# EAGLE design Hardware-Neuron (EAGLE 9.3.0)
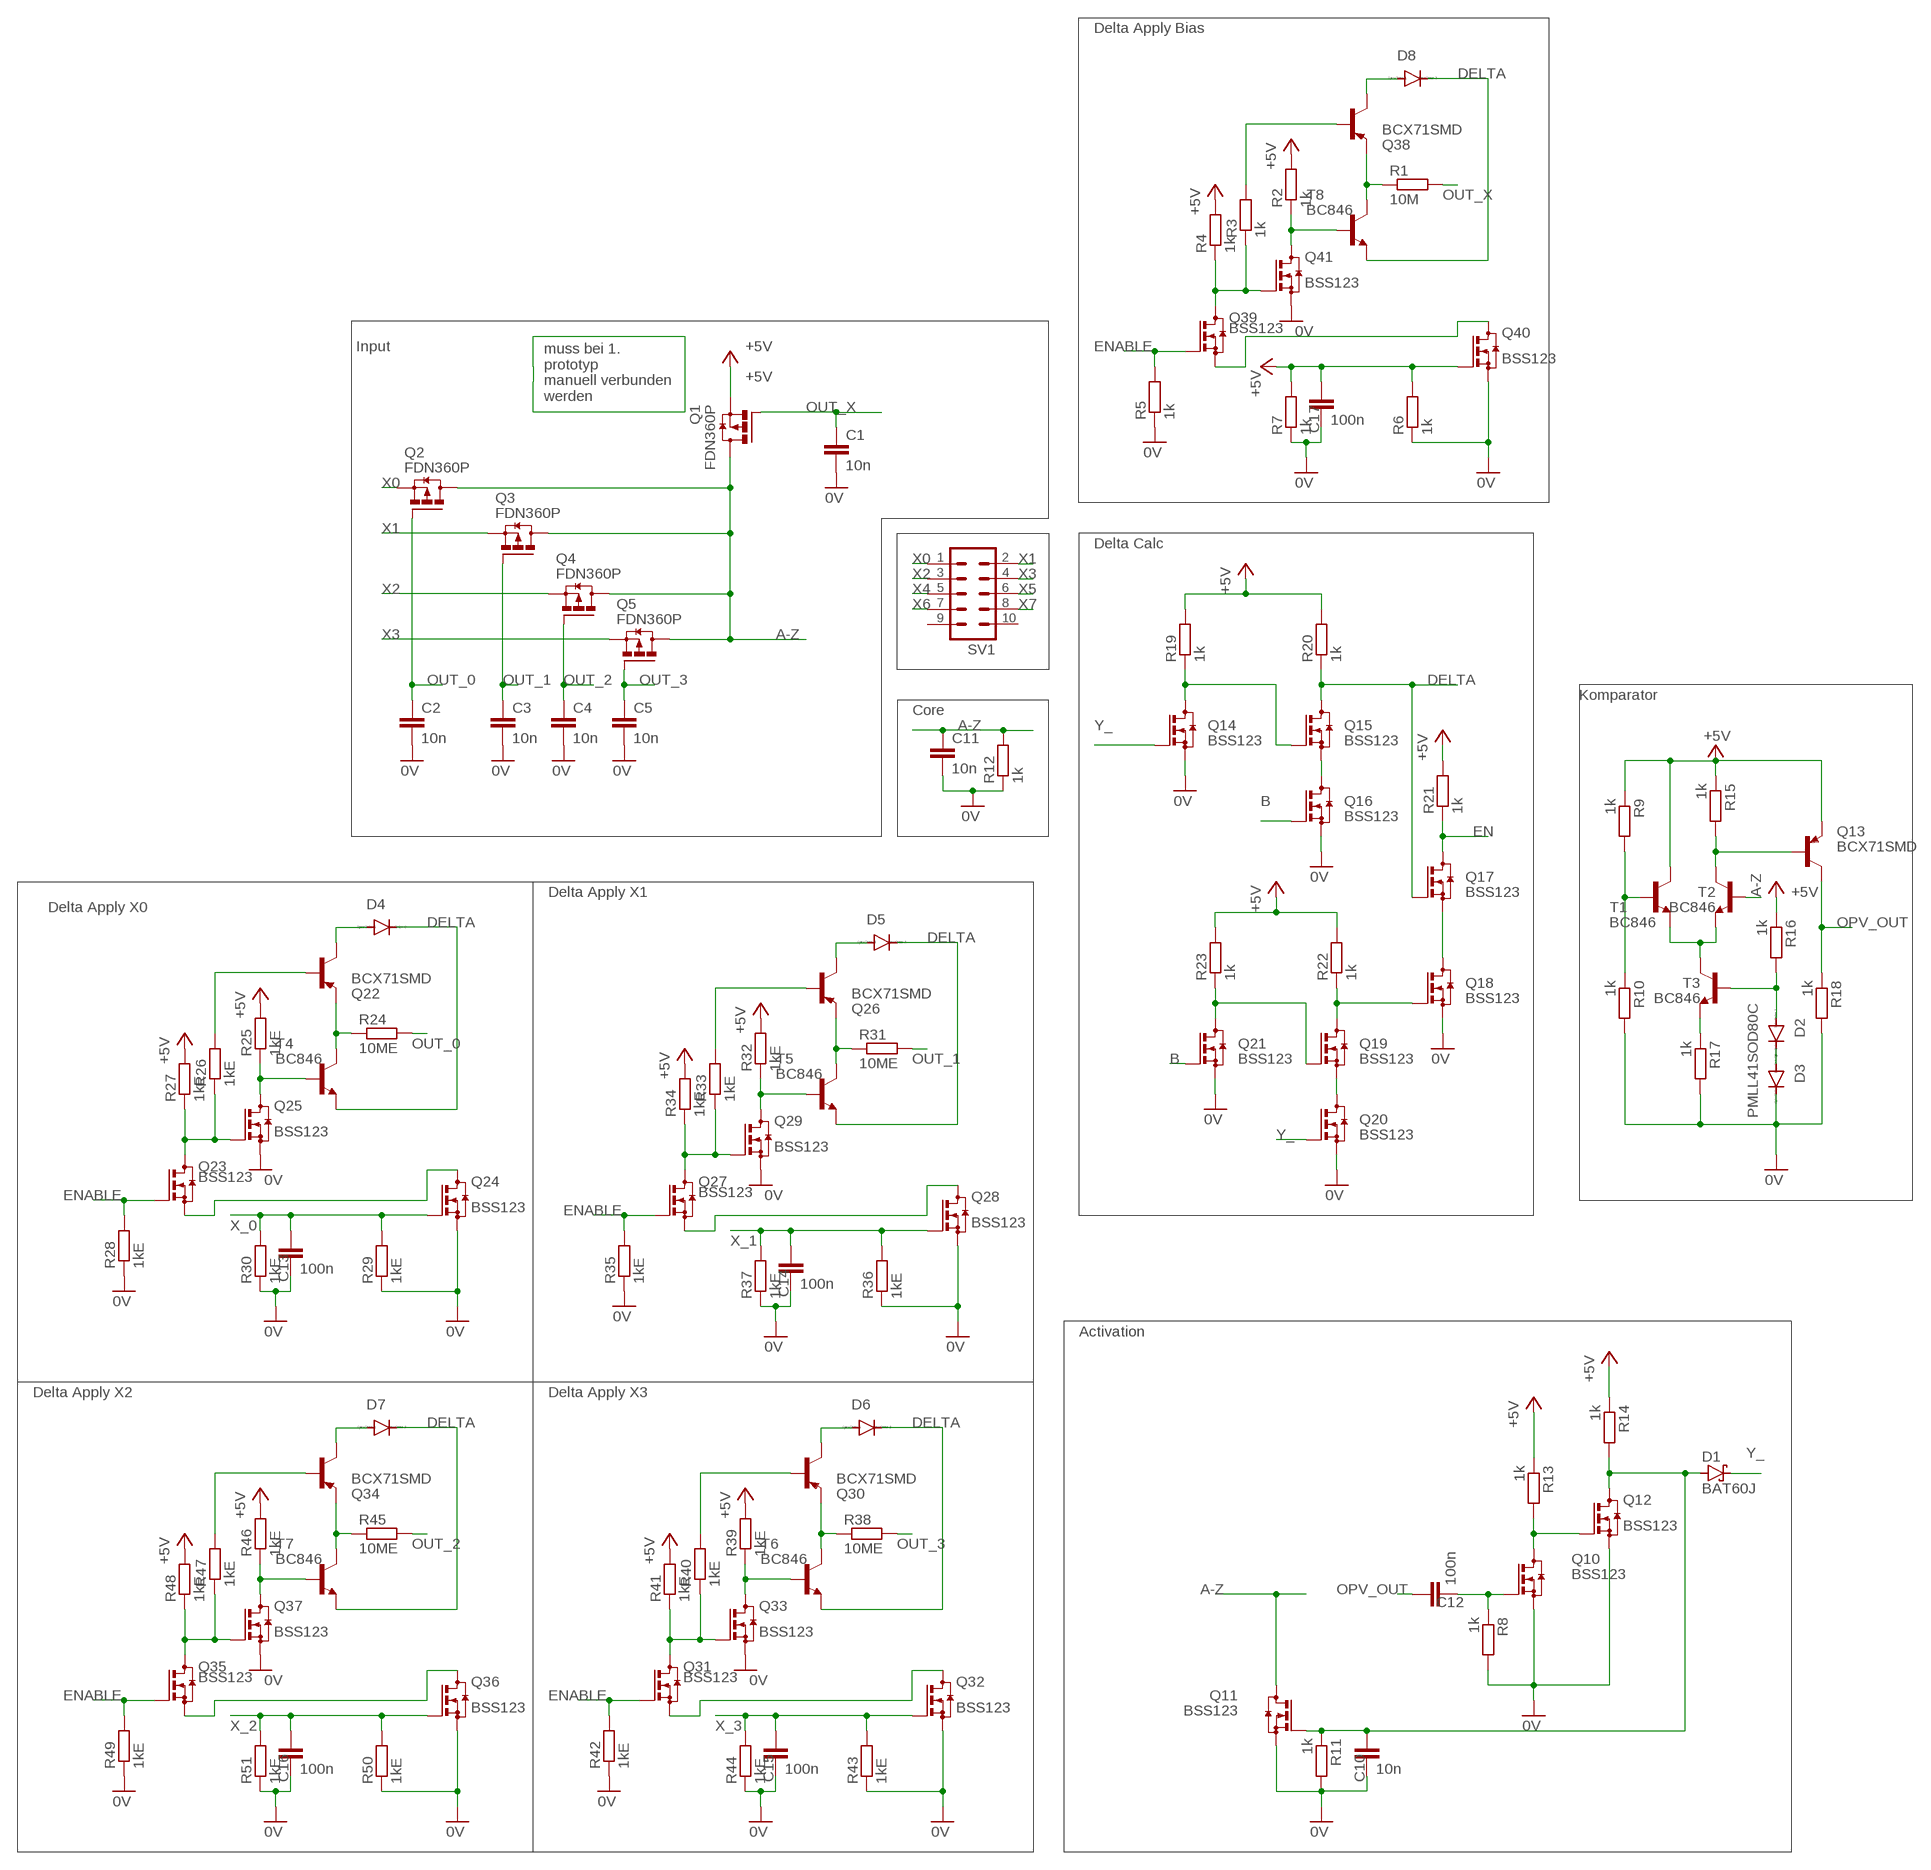
[diagram p0: schematic, sheet 1]

## Parts
C1  10n  C-EUC1206  [C1206]
C2  10n  C-EUC1206  [C1206]
C3  10n  C-EUC1206  [C1206]
C4  10n  C-EUC1206  [C1206]
C5  10n  C-EUC1206  [C1206]
C10  10n  C-EUC1206  [C1206]
C11  10n  C-EUC1206  [C1206]
C12  100n  C-EUC1206  [C1206]
C13  100n  C-EUC1206  [C1206]
C14  100n  C-EUC1206  [C1206]
C15  100n  C-EUC1206  [C1206]
C16  100n  C-EUC1206  [C1206]
C17  100n  C-EUC1206  [C1206]
D1  BAT60J  [SOD323_ST]
D2  PMLL41SOD80C  [SOD80C]
D3  PMLL41SOD80C  [SOD80C]
D4  PMLL41SOD80C  [SOD80C]
D5  PMLL41SOD80C  [SOD80C]
D6  PMLL41SOD80C  [SOD80C]
D7  PMLL41SOD80C  [SOD80C]
D8  PMLL41SOD80C  [SOD80C]
Q1  FDN360P  [SUPER-SOT3]
Q2  FDN360P  [SUPER-SOT3]
Q3  FDN360P  [SUPER-SOT3]
Q4  FDN360P  [SUPER-SOT3]
Q5  FDN360P  [SUPER-SOT3]
Q10  BSS123  [SOT23]
Q11  BSS123  [SOT23]
Q12  BSS123  [SOT23]
Q13  BCX71SMD  [SOT23]
Q14  BSS123  [SOT23]
Q15  BSS123  [SOT23]
Q16  BSS123  [SOT23]
Q17  BSS123  [SOT23]
Q18  BSS123  [SOT23]
Q19  BSS123  [SOT23]
Q20  BSS123  [SOT23]
Q21  BSS123  [SOT23]
Q22  BCX71SMD  [SOT23]
Q23  BSS123  [SOT23]
Q24  BSS123  [SOT23]
Q25  BSS123  [SOT23]
Q26  BCX71SMD  [SOT23]
Q27  BSS123  [SOT23]
Q28  BSS123  [SOT23]
Q29  BSS123  [SOT23]
Q30  BCX71SMD  [SOT23]
Q31  BSS123  [SOT23]
Q32  BSS123  [SOT23]
Q33  BSS123  [SOT23]
Q34  BCX71SMD  [SOT23]
Q35  BSS123  [SOT23]
Q36  BSS123  [SOT23]
Q37  BSS123  [SOT23]
Q38  BCX71SMD  [SOT23]
Q39  BSS123  [SOT23]
Q40  BSS123  [SOT23]
Q41  BSS123  [SOT23]
R1  10M  R-EU_R1206  [R1206]
R2  1k  R-EU_R1206  [R1206]
R3  1k  R-EU_R1206  [R1206]
R4  1k  R-EU_R1206  [R1206]
R5  1k  R-EU_R1206  [R1206]
R6  1k  R-EU_R1206  [R1206]
R7  1k  R-EU_R1206  [R1206]
R8  1k  R-EU_R1206  [R1206]
R9  1k  R-EU_R1206  [R1206]
R10  1k  R-EU_R1206  [R1206]
R11  1k  R-EU_R1206  [R1206]
R12  1k  R-EU_R1206  [R1206]
R13  1k  R-EU_R1206  [R1206]
R14  1k  R-EU_R1206  [R1206]
R15  1k  R-EU_R1206  [R1206]
R16  1k  R-EU_R1206  [R1206]
R17  1k  R-EU_R1206  [R1206]
R18  1k  R-EU_R1206  [R1206]
R19  1k  R-EU_R1206  [R1206]
R20  1k  R-EU_R1206  [R1206]
R21  1k  R-EU_R1206  [R1206]
R22  1k  R-EU_R1206  [R1206]
R23  1k  R-EU_R1206  [R1206]
R24  10ME  R-EU_R1206  [R1206]
R25  1kE  R-EU_R1206  [R1206]
R26  1kE  R-EU_R1206  [R1206]
R27  1kE  R-EU_R1206  [R1206]
R28  1kE  R-EU_R1206  [R1206]
R29  1kE  R-EU_R1206  [R1206]
R30  1kE  R-EU_R1206  [R1206]
R31  10ME  R-EU_R1206  [R1206]
R32  1kE  R-EU_R1206  [R1206]
R33  1kE  R-EU_R1206  [R1206]
R34  1kE  R-EU_R1206  [R1206]
R35  1kE  R-EU_R1206  [R1206]
R36  1kE  R-EU_R1206  [R1206]
R37  1kE  R-EU_R1206  [R1206]
R38  10ME  R-EU_R1206  [R1206]
R39  1kE  R-EU_R1206  [R1206]
R40  1kE  R-EU_R1206  [R1206]
R41  1kE  R-EU_R1206  [R1206]
R42  1kE  R-EU_R1206  [R1206]
R43  1kE  R-EU_R1206  [R1206]
R44  1kE  R-EU_R1206  [R1206]
R45  10ME  R-EU_R1206  [R1206]
R46  1kE  R-EU_R1206  [R1206]
R47  1kE  R-EU_R1206  [R1206]
R48  1kE  R-EU_R1206  [R1206]
R49  1kE  R-EU_R1206  [R1206]
R50  1kE  R-EU_R1206  [R1206]
R51  1kE  R-EU_R1206  [R1206]
SV1  ML10  [ML10]
T1  BC846  [SOT23]
T2  BC846  [SOT23]
T3  BC846  [SOT23]
T4  BC846  [SOT23]
T5  BC846  [SOT23]
T6  BC846  [SOT23]
T7  BC846  [SOT23]
T8  BC846  [SOT23]

## Nets
0V: C1.2 C2.2 C3.2 C4.2 C5.2 C10.2 C11.2 C13.2 C14.2 C15.2 C16.2 C17.2 D3.C Q10.2(S) Q11.2(S) Q12.2(S) Q14.2(S) Q16.2(S) Q18.2(S) Q20.2(S) Q21.2(S) Q24.2(S) Q25.2(S) Q28.2(S) Q29.2(S) Q32.2(S) Q33.2(S) Q36.2(S) Q37.2(S) Q40.2(S) Q41.2(S) R5.1 R6.1 R7.1 R8.2 R10.2 R11.2 R12.1 R17.2 R18.2 R28.1 R29.1 R30.1 R35.1 R36.1 R37.1 R42.1 R43.1 R44.1 R49.1 R50.1 R51.1
+5V: C17.1 Q1.2(S) Q13.2(E) Q40.1(G) R2.2 R4.2 R6.2 R7.2 R9.1 R13.1 R14.1 R15.1 R16.1 R19.2 R20.2 R21.2 R22.2 R23.2 R25.2 R27.2 R32.2 R34.2 R39.2 R41.2 R46.2 R48.2 T1.3(C)
A-Z: C11.1 Q1.3(D) Q2.3(D) Q3.3(D) Q4.3(D) Q5.3(D) Q11.3(D) R12.2 T2.1(B)
B: Q16.1(G) Q21.1(G)
DELTA: D4.C D5.C D6.C D7.C D8.C Q15.3(D) Q17.1(G) R20.1 T4.2(E) T5.2(E) T6.2(E) T7.2(E) T8.2(E)
EN: Q17.3(D) R21.1
ENABLE: Q23.1(G) Q27.1(G) Q31.1(G) Q35.1(G) Q39.1(G) R5.2 R28.2 R35.2 R42.2 R49.2
N$1: Q41.3(D) R2.1 T8.1(B)
N$2: Q38.2(E) R1.1 T8.3(C)
N$3: C12.2 Q10.1(G) R8.1
N$4: C10.1 D1.A Q11.1(G) Q12.3(D) R11.1 R14.2
N$5: Q10.3(D) Q12.1(G) R13.2
N$6: Q25.3(D) R25.1 T4.1(B)
N$7: Q23.2(S) Q24.3(D)
N$8: Q22.2(E) R24.1 T4.3(C)
N$9: D8.A Q38.3(C)
N$10: Q38.1(B) R3.2
N$11: Q39.3(D) Q41.1(G) R3.1 R4.1
N$12: Q39.2(S) Q40.3(D)
N$13: D2.C D3.A
N$14: R9.2 R10.1 T1.1(B)
N$25: R17.1 T3.2(E)
N$26: Q13.1(B) R15.2 T2.3(C)
N$27: T1.2(E) T2.2(E) T3.3(C)
N$28: Q29.3(D) R32.1 T5.1(B)
N$29: D2.A R16.2 T3.1(B)
N$30: Q14.3(D) Q15.1(G) R19.1
N$31: D4.A Q22.3(C)
N$32: Q15.2(S) Q16.3(D)
N$33: Q26.2(E) R31.1 T5.3(C)
N$34: Q22.1(B) R26.2
N$35: Q23.3(D) Q25.1(G) R26.1 R27.1
N$36: Q18.1(G) Q19.3(D) R22.1
N$37: Q19.1(G) Q21.3(D) R23.1
N$38: D5.A Q26.3(C)
N$39: Q26.1(B) R33.2
N$40: Q17.2(S) Q18.3(D)
N$41: Q27.3(D) Q29.1(G) R33.1 R34.1
N$42: Q27.2(S) Q28.3(D)
N$43: Q19.2(S) Q20.3(D)
N$44: Q33.3(D) R39.1 T6.1(B)
N$45: Q30.2(E) R38.1 T6.3(C)
N$46: D6.A Q30.3(C)
N$47: Q30.1(B) R40.2
N$48: Q31.3(D) Q33.1(G) R40.1 R41.1
N$49: Q31.2(S) Q32.3(D)
N$50: Q37.3(D) R46.1 T7.1(B)
N$51: Q34.2(E) R45.1 T7.3(C)
N$52: D7.A Q34.3(C)
N$53: Q34.1(B) R47.2
N$54: Q35.3(D) Q37.1(G) R47.1 R48.1
N$55: Q35.2(S) Q36.3(D)
OPV_OUT: C12.1 Q13.3(C) R18.1
OUT_0: C2.1 Q2.1(G) R24.2
OUT_1: C3.1 Q3.1(G) R31.2
OUT_2: C4.1 Q4.1(G) R45.2
OUT_3: C5.1 Q5.1(G) R38.2
OUT_X: C1.1 Q1.1(G) R1.2
X0: Q2.2(S) SV1.1
X1: Q3.2(S) SV1.2
X2: Q4.2(S) SV1.3
X3: Q5.2(S) SV1.4
X4: SV1.5
X5: SV1.6
X6: SV1.7
X7: SV1.8
X_0: C13.1 Q24.1(G) R29.2 R30.2
X_1: C14.1 Q28.1(G) R36.2 R37.2
X_2: C16.1 Q36.1(G) R50.2 R51.2
X_3: C15.1 Q32.1(G) R43.2 R44.2
Y_: D1.C Q14.1(G) Q20.1(G)
Unconnected: SV1.9 SV1.10

## Notes on the sheet
- Delta Apply Bias
- Input
- muss bei 1.
  prototyp 
  manuell verbunden
  werden
- Delta Calc
- Komparator
- Core
- Delta Apply X1
- Delta Apply X0
- Activation
- Delta Apply X2 | Delta Apply X3

## Library data of the parts
C1-C5 C10-C17 = rcl:C-EU: CAPACITOR, European symbol; SPICEPREFIX: C
D1 = diode:BAT60J: Schottky barrier diode Source: www.st.com, BAT60J.pdf
D2-D8 = diode:PMLL41*: High-speed diodes Source: http://www.semiconductors.philips.com/acrobat_download/datasheets/PMLL4150_2.pdf
Q1-Q5 = transistor-power:FDN360P: Single P-Channel, PowerTrench (R) MOSFET Source: http://www.fairchildsemi.com/ds/FD/FDN360P.pdf
Q10-Q12 Q14-Q21 Q23-Q25 Q27-Q29 Q31-Q33 Q35-Q37 Q39-Q41 = transistor-small-signal:BSS123: N-CHANNEL MOS FET
Q13 Q22 Q26 Q30 Q34 Q38 = transistor-pnp:BCX71SMD: PNP Transistor
R1-R51 = rcl:R-EU_: RESISTOR, European symbol; SPICEPREFIX: R
SV1 = con-harting-ml:ML10: HARTING; OC_FARNELL: unknown; OC_NEWARK: unknown
T1-T8 = transistor:BC846: NPN TRANSISTOR

## Board
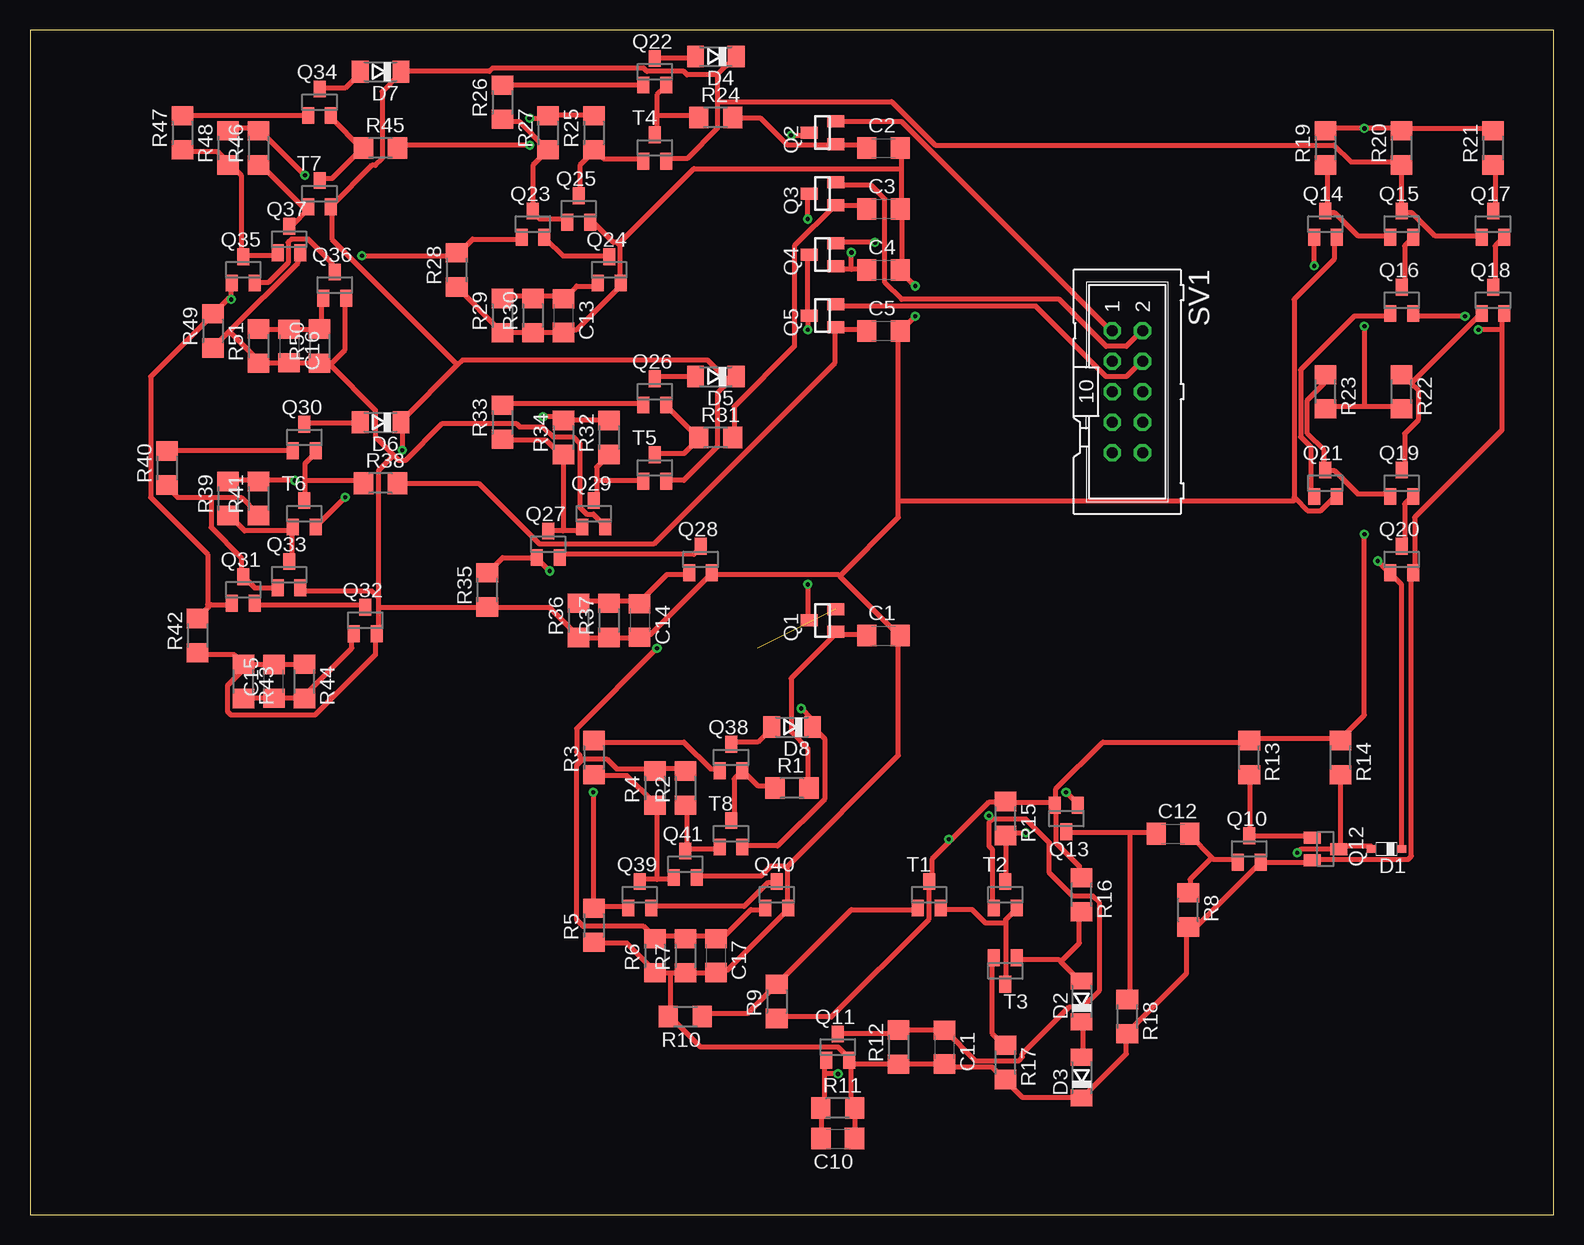
[diagram p1: board, top side]
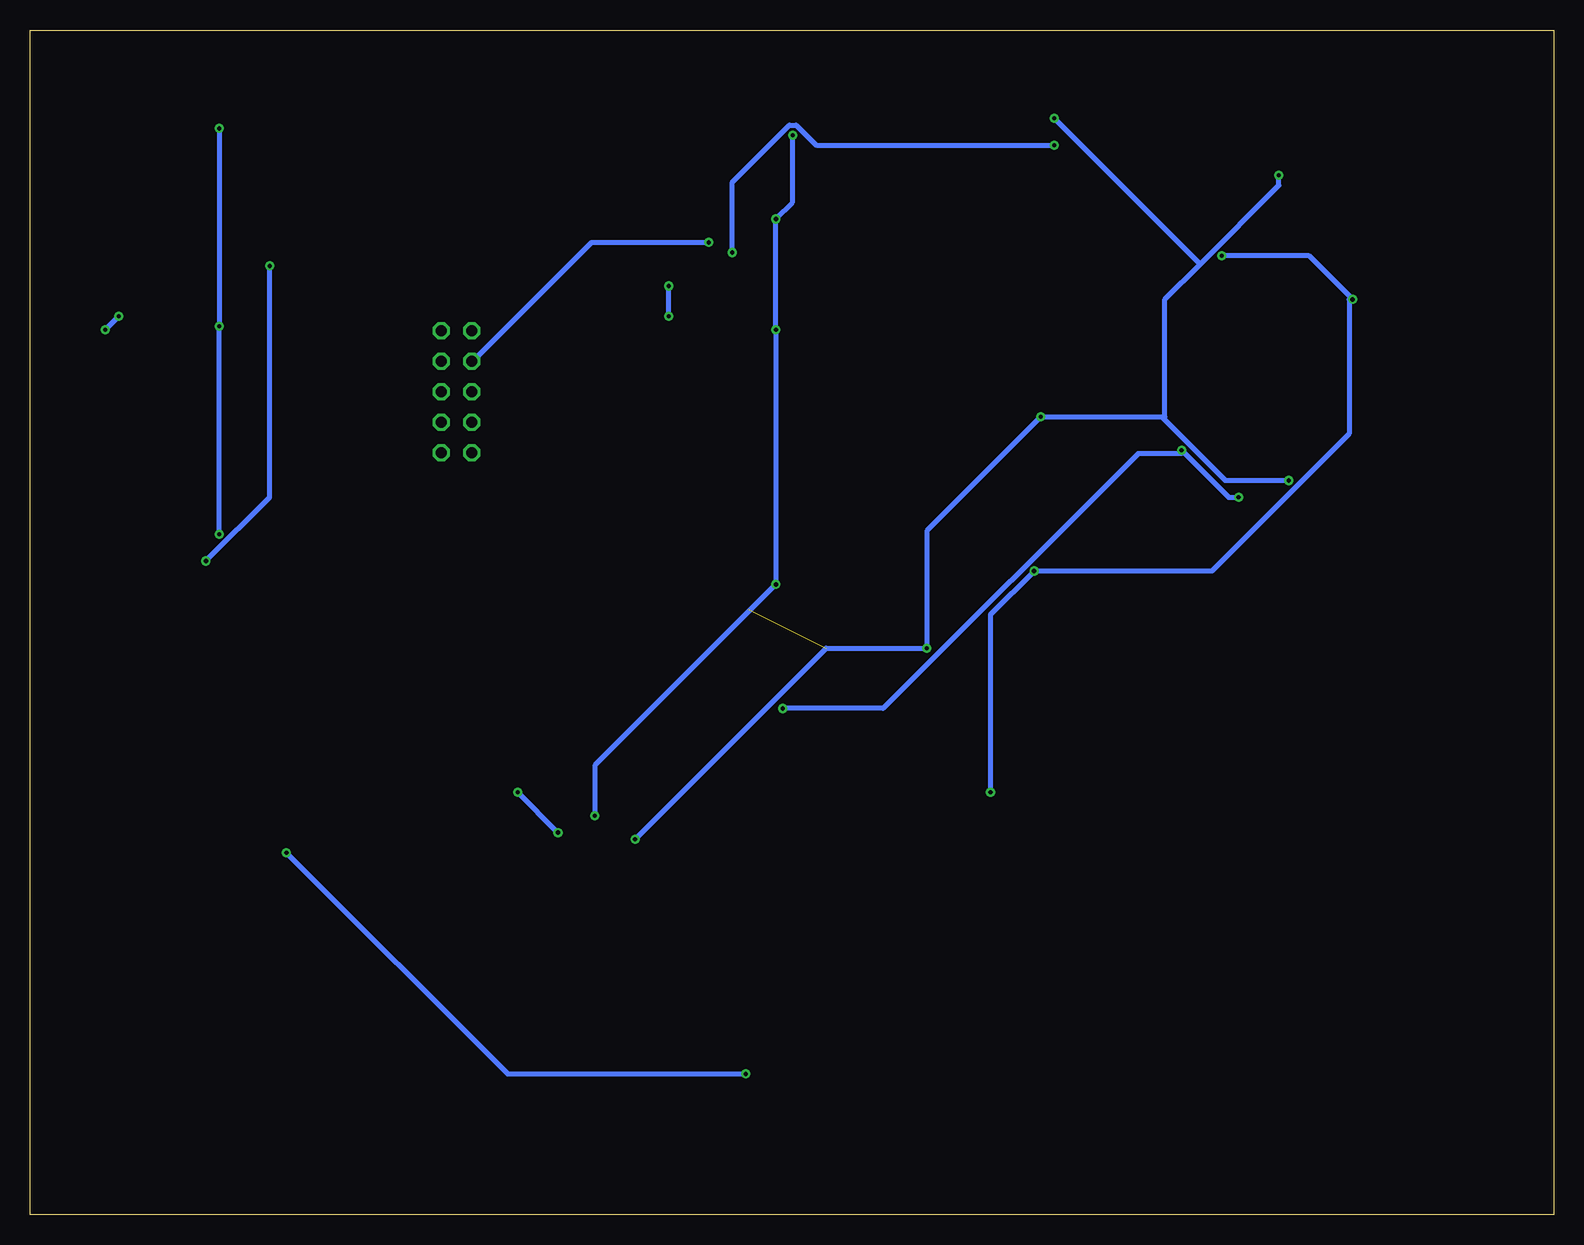
[diagram p2: board, bottom side, seen from below]

Size 126.98 x 98.73 mm. Coordinates in mm from the lower left corner, seen from the top.
Outline: 0,0 126.98,0 126.98,98.73 0,98.73 0,0
Copper layers (1*16): Top 0.035mm / dielectric 1.5mm / Bottom 0.035mm
Design rules "default *": minimum track width 16mil, minimum drill 0.35mm, track to track 6mil, track to pad 6mil, pad to pad 6mil, via to via 6mil, smd to smd 6mil, copper to edge 40mil, drill to drill 6mil, minimum pad ring 10mil, minimum via ring 8mil, stop-mask expansion 4mil, vias tented up to drill 0mil, thermal gap 10mil

### Footprints (pad centres in the part's own frame; a part is rotated, then mirrored left to right if it is on the bottom)
C1206 = smd 1.6 x 1.8: 1 -1.4,0; 2 1.4,0
SOD323_ST = smd 0.8 x 0.6: A 1.25,0; C -1.25,0
SOD80C = smd 1.4 x 1.8: A 1.7,0; C -1.7,0
SUPER-SOT3 = smd 1 x 1.4: 1 -0.95,-1.1; 2 0.95,-1.1; 3 0,1.1
SOT23 = smd 1 x 1.4: 1 -0.95,-1.1; 2 0.95,-1.1; 3 0,1.1
R1206 = smd 1.6 x 1.803: 1 -1.422,0; 2 1.422,0
ML10 = drill 0.914 octagon: 1 -5.08,-1.27; 2 -5.08,1.27; 3 -2.54,-1.27; 4 -2.54,1.27; 5 0,-1.27; 6 0,1.27; 7 2.54,-1.27; 8 2.54,1.27; 9 5.08,-1.27; 10 5.08,1.27

### Placement (x,y rotation side)
C1  71.12,48.26 0 top
C2  71.12,88.9 0 top
C3  71.12,83.82 0 top
C4  71.12,78.74 0 top
C5  71.12,73.66 0 top
C10  67.31,6.35 0 top
C11  76.2,13.97 270 top
C12  95.25,31.75 0 top
C13  44.45,74.93 270 top
C14  50.8,49.53 270 top
C15  20.32,44.45 90 top
C16  21.59,72.39 270 top
C17  57.15,21.59 270 top
D1  113.03,30.48 180 top
D2  87.63,17.78 90 top
D3  87.63,11.43 90 top
D4  57.15,96.52 180 top
D5  57.15,69.85 180 top
D6  29.21,66.04 180 top
D7  29.21,95.25 180 top
D8  63.5,40.64 180 top
Q1  66.04,49.53 90 top
Q2  66.04,90.17 90 top
Q3  66.04,85.09 90 top
Q4  66.04,80.01 90 top
Q5  66.04,74.93 90 top
Q10  101.6,30.48 0 top
Q11  67.31,13.97 0 top
Q12  107.95,30.48 270 top
Q13  86.36,33.02 180 top
Q14  107.95,82.55 0 top
Q15  114.3,82.55 0 top
Q16  114.3,76.2 0 top
Q17  121.92,82.55 0 top
Q18  121.92,76.2 0 top
Q19  114.3,60.96 0 top
Q20  114.3,54.61 0 top
Q21  107.95,60.96 0 top
Q22  52.07,95.25 0 top
Q23  41.91,82.55 0 top
Q24  48.26,78.74 0 top
Q25  45.72,83.82 0 top
Q26  52.07,68.58 0 top
Q27  43.18,55.88 0 top
Q28  55.88,54.61 0 top
Q29  46.99,58.42 0 top
Q30  22.86,64.77 0 top
Q31  17.78,52.07 0 top
Q32  27.94,49.53 0 top
Q33  21.59,53.34 0 top
Q34  24.13,92.71 0 top
Q35  17.78,78.74 0 top
Q36  25.4,77.47 0 top
Q37  21.59,81.28 0 top
Q38  58.42,38.1 0 top
Q39  50.8,26.67 0 top
Q40  62.23,26.67 0 top
Q41  54.61,29.21 0 top
R1  63.5,35.56 0 top
R2  54.61,35.56 90 top
R3  46.99,38.1 90 top
R4  52.07,35.56 90 top
R5  46.99,24.13 90 top
R6  52.07,21.59 90 top
R7  54.61,21.59 90 top
R8  96.52,25.4 270 top
R9  62.23,17.78 90 top
R10  54.61,16.51 180 top
R11  67.31,8.89 0 top
R12  72.39,13.97 90 top
R13  101.6,38.1 270 top
R14  109.22,38.1 270 top
R15  81.28,33.02 270 top
R16  87.63,26.67 270 top
R17  81.28,12.7 270 top
R18  91.44,16.51 270 top
R19  107.95,88.9 90 top
R20  114.3,88.9 90 top
R21  121.92,88.9 90 top
R22  114.3,68.58 270 top
R23  107.95,68.58 270 top
R24  57.15,91.44 0 top
R25  46.99,90.17 90 top
R26  39.37,92.71 90 top
R27  43.18,90.17 90 top
R28  35.56,78.74 90 top
R29  39.37,74.93 90 top
R30  41.91,74.93 90 top
R31  57.15,64.77 0 top
R32  48.26,64.77 90 top
R33  39.37,66.04 90 top
R34  44.45,64.77 90 top
R35  38.1,52.07 90 top
R36  45.72,49.53 90 top
R37  48.26,49.53 90 top
R38  29.21,60.96 0 top
R39  16.51,59.69 90 top
R40  11.43,62.23 90 top
R41  19.05,59.69 90 top
R42  13.97,48.26 90 top
R43  17.78,44.45 270 top
R44  22.86,44.45 270 top
R45  29.21,88.9 0 top
R46  19.05,88.9 90 top
R47  12.7,90.17 90 top
R48  16.51,88.9 90 top
R49  15.24,73.66 90 top
R50  24.13,72.39 90 top
R51  19.05,72.39 90 top
SV1  91.44,68.58 270 top
T1  74.93,26.67 0 top
T2  81.28,26.67 0 top
T3  81.28,20.32 180 top
T4  52.07,88.9 0 top
T5  52.07,62.23 0 top
T6  22.86,58.42 0 top
T7  24.13,85.09 0 top
T8  58.42,31.75 0 top

### Tracks (layer width: path | path; a pad name or v marks a point on that pad's centre or on a via)
0V  (via drill 0.35)
  Top 0.406: 16.62,73.62 15.37,72.36 R49.1 | 16.62,73.62 22.35,79.35 22.35,79.91 Q37.2 | 30.32,63.28 28.78,64.82 28.78,67.06 25.01,70.83 | 30.32,63.28 30.73,62.87 31.29,62.87 34.37,65.94 40.51,65.94 40.79,65.66 42.75,65.66 43.59,64.82 45.26,64.82 45.82,64.26 45.82,58.95 46.38,58.4 46.94,58.4 47.78,57.56 Q29.2 | 25.01,70.83 24.87,70.97 24.31,70.97 R50.1 24.03,70.97 21.79,70.97 C16.2 21.51,70.97 19.28,70.97 R51.1 19,71.25 16.62,73.62 | 25.01,70.83 26.26,72.08 26.26,76.28 Q36.2 | 41.91,73.48 39.4,73.48 R29.1 39.12,73.76 35.76,77.11 R28.1 | 72.64,83.82 72.64,78.79 C4.2 72.64,78.51 v73.76,77.39 | 72.64,83.82 72.64,87.17 | 72.64,87.17 72.64,88.85 C2.2 | 72.64,83.82 C3.2 | 49.03,80.89 49.17,80.75 49.17,77.67 Q24.2 49.17,77.39 45.54,73.76 44.7,73.76 C13.2 44.42,73.48 41.91,73.48 | 49.03,80.89 48.9,81.03 48.62,81.03 46.94,82.7 Q25.2 | 72.64,87.17 55.32,87.17 49.03,80.89 | 41.91,73.48 R30.1 | R44.1 22.63,45.82 20.4,45.82 C15.2 20.12,45.82 17.88,45.82 R43.1 | R42.1 13.97,46.66 17.04,46.66 17.6,46.1 R43.1 | 28.92,51.55 29.06,51.41 29.06,50.57 | 28.92,51.55 28.5,51.97 22.63,51.97 Q33.2 | 29.06,50.57 29.06,48.62 Q32.2 28.78,48.34 28.78,46.66 23.75,41.63 16.76,41.63 16.48,41.91 16.48,44.15 17.6,45.26 17.6,45.82 R43.1 | 29.06,50.57 38,50.57 R35.1 38.28,50.57 43.31,50.57 45.54,48.34 R36.1 45.82,48.06 48.06,48.06 R37.1 48.34,48.06 50.57,48.06 C14.2 50.85,48.34 51.69,48.34 56.72,53.37 Q28.2 57,53.37 67.33,53.37 67.47,53.23 | 105.47,59.65 105.33,59.79 105.33,76.28 108.69,79.63 108.69,81.31 Q14.2 | 105.47,59.65 106.45,58.67 107.57,58.67 108.69,59.79 Q21.2 | 67.47,53.23 72.36,48.34 C1.2 72.36,48.06 72.36,38.28 63.01,28.92
  Top 0.406: 72.36,59.51 72.36,58.12 67.47,53.23 | 72.36,59.51 72.36,73.48 C5.2 72.64,73.76 v73.76,74.88 | 72.36,59.51 105.33,59.51 105.47,59.65 | 30.32,63.28 29.06,62.03 29.06,51.69 28.92,51.55 | 122.66,73.76 122.66,74.88 Q18.2 | 122.66,73.76 122.66,65.38 115.39,58.12 115.39,53.65 Q20.2 115.11,53.37 115.11,29.9 114.83,29.62 107.01,29.62 Q12.2 106.73,29.34 102.82,29.34 Q10.2 102.54,29.34 97.23,24.03 96.67,24.03 R8.2 96.39,23.75 96.39,20.12 91.64,15.37 R18.2 91.36,15.09 91.36,13.41 87.73,9.78 D3.C 87.45,9.78 82.7,9.78 81.31,11.18 R17.2 81.03,11.46 80.19,12.29 76.28,12.29 C11.2 76,12.57 72.64,12.57 R12.1 72.36,12.57 68.45,12.57 | v119.58,74.88 115.39,74.88 Q16.2 | 122.66,73.76 v120.7,73.76 | 53.37,20.12 54.48,20.12 R7.1 54.76,20.12 57,20.12 C17.2 57.28,20.4 58.12,20.4 63.14,25.43 Q40.2 63.14,25.7 63.14,28.78 63.01,28.92 | 53.37,20.12 52.25,20.12 R6.1 51.97,20.4 49.73,22.63 47.22,22.63 R5.1 | 53.37,20.12 53.37,16.76 R10.2 53.37,16.48 55.88,13.97 67.33,13.97 68.17,13.13 Q11.2 | 63.01,28.92 62.87,29.06 61.75,29.06 60.91,28.22 55.6,28.22 Q41.2 | 68.45,12.57 68.45,8.94 R11.2 68.73,8.66 68.73,6.43 C10.2 | 68.45,12.57 68.45,12.85 Q11.2 | 68.45,12.57 Q11.2
  Bottom 0.406: v73.76,74.88 v73.76,77.39 | v120.7,73.76 v119.58,74.88
+5V  (via drill 0.35)  (1 unrouted)
  Top 0.406: R2.2 54.48,37.16 52.25,37.16 R4.2 51.97,37.16 48.9,37.16 48.06,38 46.1,38 45.96,37.86 | Q40.1 61.19,25.43 60.07,25.43 57.84,23.19 57.28,23.19 C17.1 57,23.19 54.76,23.19 R7.2 54.48,23.19 52.25,23.19 R6.2 51.97,23.19 51.13,24.03 46.1,24.03 45.54,24.59 45.54,37.44 45.96,37.86 | R25.2 46.94,91.64 43.31,91.64 R27.2 43.03,91.36 v41.63,91.36 | R48.2 16.76,90.53 19,90.53 R46.2 19.28,90.25 v22.91,86.61 | R39.2 16.76,61.19 19,61.19 R41.2 19.28,61.19 v22.07,61.19 | R32.2 48.06,66.22 44.7,66.22 R34.2 44.42,66.22 44.15,66.5 v42.75,66.5 | v52.25,47.22 45.54,40.51 45.54,38.56 45.82,38.28 45.82,38 45.96,37.86 | 111.2,67.33 114.28,67.33 R22.2 | 111.2,67.33 108.13,67.33 R23.2 | R19.2 108.13,90.53 v111.2,90.53 114.28,90.53 R20.2 114.55,90.53 121.82,90.53 R21.2 | v111.2,74.04 111.2,67.33 | 76.69,31.15 79.91,34.37 81.03,34.37 R15.1 81.31,34.37 85.22,34.37 Q13.2 | 76.69,31.15 75.16,29.62 75.16,27.94 T1.3 74.88,27.66 74.88,24.59 66.78,16.48 62.31,16.48 R9.1 | R16.1 87.45,28.22 87.45,29.06 85.5,31.01 85.5,34.09 Q13.2 | Q13.2 85.5,34.37 85.5,35.48 89.41,39.4 101.42,39.4 R13.1 101.7,39.67 108.97,39.67 R14.1 109.25,39.67 111.2,41.63 v111.2,56.72 | v76.56,31.29 76.69,31.15
  Bottom 0.406: v22.07,61.19 27.38,61.19 32.55,66.36 | 32.55,66.36 32.69,66.5 v42.75,66.5 52.25,57 v52.25,47.22 60.63,47.22 v76.56,31.29 | v22.91,86.61 22.91,85.78 29.48,79.21 | 29.48,79.21 32.41,76.28 32.41,66.5 32.55,66.36 | 29.48,79.21 v41.63,91.36 | v111.2,90.53 v111.2,74.04 v111.2,56.72
A-Z  (via drill 0.35)
  Top 0.406: Q11.3 67.33,15.09 72.08,15.09 72.36,15.37 R12.2 72.64,15.37 76,15.37 C11.1 76.28,15.37 78.79,12.85 82.42,12.85 82.7,13.13 82.7,13.41 86.61,17.32 87.73,17.32 89.13,18.72 89.13,25.98 88.57,26.54 86.89,26.54 84.94,28.5 84.94,31.01 82.98,32.97 80.19,32.97 80.05,32.83 | 80.05,32.83 79.91,32.69 79.91,30.73 80.19,30.45 80.19,25.7 T2.1 | v64.82,52.53 64.82,49.73 Q1.3 | v64.82,73.76 64.82,74.88 Q5.3 64.82,75.16 64.82,79.91 Q4.3 | v64.82,82.98 64.82,84.94 Q3.3 | v63.42,89.97 64.82,89.97 Q2.3 | v79.91,33.25 79.91,32.97 80.05,32.83
  Bottom 0.406: v63.42,89.97 63.42,84.38 v64.82,82.98 v64.82,73.76 v64.82,52.53 79.91,37.44 v79.91,33.25
B
  Top 0.406: Q21.1 106.73,60.07 106.73,63.98 105.89,64.82 105.89,70.41 110.36,74.88 113.16,74.88 Q16.1
DELTA  (via drill 0.35)
  Top 0.406: T8.2 59.51,30.73 62.31,30.73 66.22,34.65 66.22,39.67 65.38,40.51 D8.C 65.1,40.79 65.1,41.35 v64.26,42.19 | 58.26,69.43 58.67,69.85 D5.C | 58.26,69.43 57.28,68.45 57.28,63.98 54.48,61.19 53.09,61.19 T5.2 | v26.26,59.79 24.03,57.56 T6.2 | v31.01,63.7 31.01,65.94 D6.C 31.01,66.22 35.62,70.83 | 58.26,69.43 56.44,71.25 36.04,71.25 35.62,70.83 | Q17.1 120.7,81.58 117.07,81.58 115.11,83.54 114.55,83.54 Q15.3 114.28,83.82 114.28,87.45 R20.1 114.28,87.73 110.08,87.73 108.69,89.13 75.44,89.13 71.81,92.76 57.28,92.76 | 57.28,95 57.28,92.76 | 57.28,92.76 57.28,90.53 54.76,88.01 53.09,88.01 T4.2 | 57.28,95 58.67,96.39 D4.C | 57.28,95 54.76,95 54.48,95.28 51.41,95.28 51.13,95.56 38.56,95.56 38.28,95.28 31.01,95.28 D7.C 30.73,95 29.34,93.6 29.34,88.01 28.78,87.45 28.5,87.45 25.15,84.1 T7.2 25.15,83.82 25.15,81.31 35.62,70.83
  Bottom 0.406: v26.26,59.79 27.1,59.79 v31.01,63.7 31.01,63.42 34.65,63.42 55.88,42.19 v64.26,42.19
EN
  Top 0.406: Q17.3 122.1,83.82 122.1,87.45 R21.1
ENABLE  (via drill 0.35)
  Top 0.406: Q39.1 49.73,25.7 47.22,25.7 R5.2 46.94,25.7 v46.94,35.2 | 42.19,54.76 39.4,54.76 38.28,53.65 R35.2 | 42.19,54.76 v43.31,53.65 | 42.19,54.76 Q27.1 | Q23.1 40.79,81.31 36.88,81.31 35.76,80.19 R28.2 35.48,79.91 v27.66,79.91 | 14.95,50.71 13.97,49.73 R42.2 | 14.95,50.71 15.09,50.85 16.76,50.85 Q31.1 | 16.62,76.42 15.37,75.16 R49.2 15.09,74.88 10.06,69.85 10.06,59.79 14.81,55.04 14.81,50.85 14.95,50.71 | 16.62,76.42 16.76,76.56 16.76,77.39 Q35.1 | v16.76,76.28 16.62,76.42
  Bottom 0.406: v46.94,35.2 46.94,50.01 v43.31,53.65 28.5,53.65 17.04,65.1 17.04,76.28 v16.76,76.28 20.4,79.91 v27.66,79.91
N$1
  Top 0.406: 54.76,30.45 57.28,30.45 T8.1 | 54.76,30.45 54.76,34.09 R2.1 | 54.76,30.45 Q41.3
N$2
  Top 0.406: T8.3 58.67,32.97 58.67,36.32 59.23,36.88 Q38.2 59.51,36.88 60.63,35.76 62.03,35.76 R1.1
N$3
  Top 0.406: 98.49,29.76 96.67,31.57 C12.2 | 98.49,29.76 98.63,29.62 100.58,29.62 Q10.1 | 98.49,29.76 96.67,27.94 96.67,26.82 R8.1
N$4  (via drill 0.35)
  Top 0.406: 66.22,11.73 66.22,9.22 65.94,8.94 R11.1 65.94,8.66 65.94,6.43 C10.1 | 66.22,11.73 66.22,12.85 Q11.1 | 109.25,30.73 111.76,30.73 D1.A | 109.25,30.73 109.25,36.6 R14.2 | 109.25,30.73 Q12.3 108.97,30.45 105.89,30.45 v105.61,30.18 | v67.33,11.73 66.22,11.73
  Bottom 0.406: v67.33,11.73 87.17,11.73 v105.61,30.18
N$5
  Top 0.406: Q12.1 106.73,31.57 101.7,31.57 Q10.3 101.7,31.85 101.7,36.6 R13.2
N$6
  Top 0.406: Q25.3 45.82,84.94 45.82,87.45 46.94,88.57 R25.1 47.22,88.57 47.78,88.01 50.85,88.01 T4.1
N$7
  Top 0.406: Q24.3 48.06,79.91 44.42,79.91 43.03,81.31 Q23.2
N$8
  Top 0.406: 52.25,91.64 52.25,93.32 52.81,93.88 Q22.2 | 52.25,91.64 52.25,90.25 T4.3 | 52.25,91.64 55.6,91.64 R24.1
N$9
  Top 0.406: Q38.3 58.67,39.4 60.63,39.4 61.75,40.51 D8.A
N$10
  Top 0.406: Q38.1 57.28,37.16 56.72,37.16 54.48,39.4 47.22,39.4 R3.2
N$11
  Top 0.406: 52.25,27.94 53.65,27.94 Q41.1 | 52.25,27.94 50.85,27.94 Q39.3 | R3.1 47.22,36.6 49.73,36.6 51.97,34.37 R4.1 52.25,34.09 52.25,27.94
N$12
  Top 0.406: Q39.2 51.97,25.7 59.51,25.7 61.47,27.66 62.03,27.66 Q40.3
N$13
  Top 0.406: D3.A 87.73,13.13 87.73,15.93 D2.C
N$14
  Top 0.406: T1.1 73.76,25.43 68.45,25.43 62.31,19.28 R9.2 62.03,19 59.79,16.76 56.16,16.76 R10.1
N$25
  Top 0.406: T3.2 80.19,21.23 80.19,15.09 81.03,14.25 R17.1
N$26  (via drill 0.35)
  Top 0.406: T2.3 81.31,27.94 81.31,31.57 R15.2 81.31,31.85 v82.98,31.85 | v86.33,35.2 87.17,34.37 Q13.1
  Bottom 0.406: v82.98,31.85 v86.33,35.2
N$27
  Top 0.406: 81.31,24.31 81.31,24.59 82.14,25.43 T2.2 | 81.31,24.31 81.31,19.28 T3.3 | 81.31,24.31 79.63,24.31 78.51,25.43 76,25.43 T1.2
N$28
  Top 0.406: 47.22,61.19 47.22,62.31 48.06,63.14 R32.1 | 47.22,61.19 47.22,59.79 Q29.3 | 47.22,61.19 50.85,61.19 T5.1
N$29
  Top 0.406: 85.92,21.09 87.45,19.56 D2.A | 85.92,21.09 85.78,21.23 82.42,21.23 T3.1 | 85.92,21.09 87.45,22.63 87.45,25.15 R16.2
N$30
  Top 0.406: Q15.1 113.16,81.58 110.64,81.58 108.69,83.54 108.13,83.54 Q14.3 108.13,83.82 108.13,87.45 R19.1
N$31
  Top 0.406: Q22.3 52.25,96.39 55.32,96.39 D4.A
N$32
  Top 0.406: Q16.3 114.55,77.39 114.55,80.75 115.11,81.31 Q15.2
N$33
  Top 0.406: T5.3 52.25,63.42 54.48,63.42 55.6,64.54 R31.1 55.6,64.82 53.09,67.33 Q26.2
N$34
  Top 0.406: Q22.1 50.85,94.16 39.4,94.16 R26.2
N$35
  Top 0.406: Q25.1 44.7,82.98 42.47,82.98 41.91,83.54 Q23.3 41.91,87.45 43.03,88.57 R27.1 43.03,88.85 40.79,91.08 39.4,91.08 R26.1
N$36
  Top 0.406: 115.11,69.29 114.55,69.85 R22.1 115.11,69.29 | 115.11,69.29 115.67,68.73 115.67,66.22 114.55,65.1 114.55,62.31 Q19.3 | 115.11,69.29 120.7,74.88 Q18.1
N$37
  Top 0.406: Q19.1 113.16,60.07 110.64,60.07 108.69,62.03 108.13,62.03 Q21.3 107.85,62.31 107.85,63.7 106.45,65.1 106.45,67.89 107.85,69.29 107.85,69.85 R23.1
N$38
  Top 0.406: D5.A 52.25,69.85 Q26.3
N$39
  Top 0.406: Q26.1 50.85,67.61 39.4,67.61 R33.2
N$40
  Top 0.406: Q18.3 122.1,77.39 122.1,80.75 122.66,81.31 Q17.2
N$41
  Top 0.406: 44.42,57 45.54,57 45.82,57.28 Q29.1 | 44.42,57 43.31,57 Q27.3 | 44.42,63.14 43.03,64.54 39.4,64.54 R33.1 | 44.42,63.14 44.42,57 | 44.42,63.14 R34.1
N$42
  Top 0.406: Q27.2 44.15,55.04 55.32,55.04 55.88,55.6 Q28.3
N$43
  Top 0.406: Q20.3 114.55,55.88 114.55,59.23 115.11,59.79 Q19.2
N$44
  Top 0.406: 21.79,57 21.79,57.28 T6.1 21.79,57 | 21.79,57 21.79,54.48 Q33.3 | 21.79,57 17.88,57 16.76,58.12 R39.1
N$45
  Top 0.406: 22.91,61.19 22.91,62.59 23.75,63.42 Q30.2 | 22.91,61.19 22.91,59.79 T6.3 | 22.91,61.19 27.66,61.19 R38.1
N$46
  Top 0.406: Q30.3 22.91,65.94 27.38,65.94 D6.A
N$47
  Top 0.406: Q30.1 21.79,63.7 11.46,63.7 R40.2
N$48
  Top 0.406: Q33.1 20.4,52.25 18.72,52.25 17.88,53.09 Q31.3 17.6,53.37 17.6,54.76 15.09,57.28 15.09,59.79 | 15.09,59.79 12.29,59.79 11.46,60.63 R40.1 | 15.09,59.79 17.6,59.79 19,58.4 R41.1
N$49
  Top 0.406: Q32.3 27.94,50.85 19,50.85 Q31.2
N$50
  Top 0.406: Q37.3 21.79,82.42 23.19,83.82 T7.1 22.91,83.82 19.28,87.45 R46.1
N$51
  Top 0.406: 27.66,88.85 25.15,86.33 24.31,86.33 T7.3 | 27.66,88.85 25.15,91.36 Q34.2 | 27.66,88.85 R45.1
N$52
  Top 0.406: Q34.3 24.31,93.88 26.26,93.88 27.38,95 D7.A
N$53
  Top 0.406: Q34.1 22.91,91.64 12.85,91.64 R47.2
N$54
  Top 0.406: Q37.1 20.4,79.91 17.88,79.91 Q35.3 17.6,79.91 17.6,86.61 16.76,87.45 R48.1 16.48,87.73 15.65,88.57 12.85,88.57 R47.1
N$55
  Top 0.406: Q35.2 19,77.67 19.84,77.67 21.51,79.35 21.51,81.03 21.79,81.31 23.19,81.31 25.15,79.35 25.15,78.79 Q36.3
OPV_OUT
  Top 0.406: 91.64,31.85 93.6,31.85 C12.1 | 91.64,31.85 86.61,31.85 Q13.3 | 91.64,31.85 91.64,18.16 R18.1
OUT_0
  Top 0.406: C2.1 69.57,89.13 67.33,89.13 Q2.1 67.06,89.13 63.14,89.13 60.91,91.36 58.67,91.36 R24.2
OUT_1
  Top 0.406: C3.1 69.57,83.82 69.29,84.1 67.33,84.1 Q3.1 67.06,84.1 63.7,80.75 63.7,72.36 58.67,67.33 58.67,64.82 R31.2
OUT_2  (via drill 0.35)
  Top 0.406: 68.45,78.79 69.57,78.79 C4.1 | 68.45,78.79 67.33,78.79 Q4.1 | v41.63,89.13 30.73,89.13 R45.2 | 68.45,78.79 v68.45,80.19
  Bottom 0.406: v41.63,89.13 61.47,89.13 63.14,90.81 63.7,90.81 68.45,86.06 v68.45,80.19
OUT_3
  Top 0.406: C5.1 69.57,73.76 67.33,73.76 Q5.1 67.06,73.76 67.06,70.97 51.97,55.88 42.47,55.88 37.44,60.91 30.73,60.91 R38.2
OUT_X
  Top 0.406: C1.1 69.57,48.34 67.33,48.34 Q1.1 67.06,48.34 63.42,44.7 63.42,40.23 64.82,38.84 64.82,35.76 R1.2
X0
  Top 0.406: Q2.2 67.33,91.08 72.64,91.08 89.97,73.76 SV1.1
X1
  Top 0.406: Q3.2 67.33,85.78 70.13,85.78 71.25,84.66 71.25,77.67 72.64,76.28 85.78,76.28 89.69,72.36 91.36,72.36 92.48,73.48 SV1.2
X2  (via drill 0.35)
  Top 0.406: v70.41,81.03 67.33,81.03 Q4.2
  Bottom 0.406: v70.41,81.03 80.19,81.03 89.97,71.25 SV1.3
X3
  Top 0.406: Q5.2 67.33,75.72 83.82,75.72 89.69,69.85 91.36,69.85 92.48,70.97 SV1.4
X_0
  Top 0.406: 41.91,76.56 39.4,76.56 R29.2 | Q24.1 47.22,77.39 45.54,77.39 44.7,76.56 C13.1 44.42,76.56 41.91,76.56 | 41.91,76.56 R30.2
X_1
  Top 0.406: R36.2 45.82,51.13 48.06,51.13 R37.2 48.34,51.13 50.57,51.13 C14.1 50.85,51.13 53.09,53.37 54.76,53.37 Q28.1
X_2
  Top 0.406: Q36.1 24.31,76.28 24.31,74.04 R50.2 24.03,73.76 21.79,73.76 C16.1 21.51,73.76 19.28,73.76 R51.2
X_3
  Top 0.406: Q32.1 26.82,48.34 26.82,47.22 22.91,43.31 R44.2 22.63,43.03 20.4,43.03 C15.1 20.12,43.03 17.88,43.03 R43.2
Y_  (via drill 0.35)
  Top 0.406: D1.C 114.28,30.73 114.28,52.53 113.44,53.37 Q20.1 113.16,53.65 v112.32,54.48 | v107.01,79.07 107.01,81.31 Q14.1
  Bottom 0.406: v107.01,79.07 107.01,59.79 v112.32,54.48